# Altium schematic sheet interfaceSignals.SchDoc: XEM7360 Breakout Board - Top
size D; DrawnBy: Nick Kettman; Organization: Opal Kelly; Address1: 13500 SW 72nd Ave Ste 100; Address2: Portland, OR 97223; Address4: http://www.opalkelly.com/; DocumentNumber: xxx; Revision: A; SheetNumber: 1; SheetTotal: 3; ProjectName: BRK7360
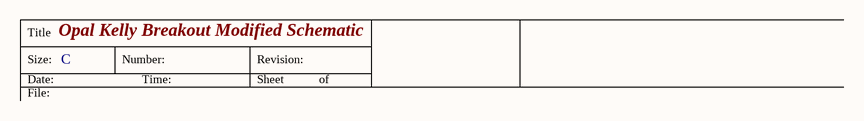
[diagram p0: interfaceSignals.SchDoc]

## Notes on the sheet
- Title
- Size:
- Date:
- File:
- Opal Kelly Breakout Modified Schematic
- C
- Number:
- Time:
- Revision:
- Sheet
- of